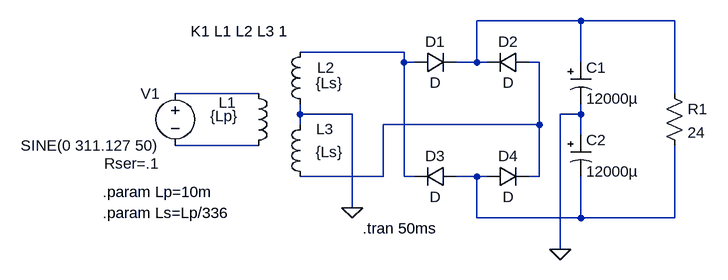
[diagram p0: schematic Rect and Filter - only.asc]
Rect and Filter - only.asc, the LTspice schematic file:
Version 4.1
SHEET 1 1676 728
WIRE 496 0 336 0
WIRE 640 0 496 0
WIRE 224 48 64 48
WIRE 224 64 224 48
WIRE 240 64 224 64
WIRE 336 64 336 0
WIRE 336 64 304 64
WIRE 352 64 336 64
WIRE 432 64 416 64
WIRE 496 64 496 0
WIRE 0 112 -128 112
WIRE 640 112 640 0
WIRE 64 144 64 128
WIRE 144 144 64 144
WIRE 496 144 496 128
WIRE 496 144 464 144
WIRE 64 160 64 144
WIRE 432 160 432 64
WIRE 432 160 192 160
WIRE 496 176 496 144
WIRE 0 192 -128 192
WIRE 192 240 192 160
WIRE 192 240 64 240
WIRE 224 240 224 64
WIRE 240 240 224 240
WIRE 336 240 304 240
WIRE 352 240 336 240
WIRE 432 240 432 160
WIRE 432 240 416 240
WIRE 144 288 144 144
WIRE 336 304 336 240
WIRE 496 304 496 240
WIRE 496 304 336 304
WIRE 640 304 640 192
WIRE 640 304 496 304
WIRE 464 352 464 144
FLAG 464 352 0
FLAG 144 288 0
SYMBOL diode 240 80 R270
WINDOW 0 32 32 VTop 2
WINDOW 3 0 32 VBottom 2
SYMATTR InstName D1
SYMBOL diode 416 80 M270
WINDOW 0 32 32 VTop 2
WINDOW 3 0 32 VBottom 2
SYMATTR InstName D2
SYMBOL diode 304 256 M270
WINDOW 0 32 32 VTop 2
WINDOW 3 0 32 VBottom 2
SYMATTR InstName D3
SYMBOL diode 352 256 R270
WINDOW 0 32 32 VTop 2
WINDOW 3 0 32 VBottom 2
SYMATTR InstName D4
SYMBOL polcap 480 64 R0
SYMATTR InstName C1
SYMATTR Value 12000µ
SYMBOL polcap 480 176 R0
SYMATTR InstName C2
SYMATTR Value 12000µ
SYMBOL voltage -128 96 M0
WINDOW 123 0 0 Left 0
WINDOW 39 24 124 Left 2
SYMATTR SpiceLine Rser=.1
SYMATTR InstName V1
SYMATTR Value SINE(0 311.127 50)
SYMBOL ind -16 208 M180
WINDOW 0 -45 82 Left 2
WINDOW 3 -58 61 Left 2
SYMATTR InstName L1
SYMATTR Value {Lp}
SYMATTR SpiceLine Rser=1m
SYMBOL ind 80 144 R180
WINDOW 0 -37 72 Left 2
WINDOW 3 -50 48 Left 2
SYMATTR InstName L2
SYMATTR Value {Ls}
SYMATTR SpiceLine Rser=1m
SYMBOL ind 80 256 R180
WINDOW 0 -36 89 Left 2
WINDOW 3 -50 54 Left 2
SYMATTR InstName L3
SYMATTR Value {Ls}
SYMATTR SpiceLine Rser=1m
SYMBOL res 624 96 R0
SYMATTR InstName R1
SYMATTR Value 24
TEXT 160 320 Left 2 !.tran 50ms
TEXT -104 16 Left 2 !K1 L1 L2 L3 1
TEXT -240 264 Left 2 !.param Lp=10m
TEXT -240 296 Left 2 !.param Ls=Lp/336

The netlist it stands for:
* Rect and Filter - only.asc
D1 N002 N001 D
D2 N003 N001 D
D3 N006 N002 D
D4 N006 N003 D
C1 N001 0 12000µ
C2 0 N006 12000µ
V1 N004 N005 SINE(0 311.127 50) Rser=.1
L1 N005 N004 {Lp} Rser=1m
L2 0 N002 {Ls} Rser=1m
L3 N003 0 {Ls} Rser=1m
R1 N001 N006 24
.model D D
.lib standard.dio
.tran 50ms
K1 L1 L2 L3 1
.param Lp=10m
.param Ls=Lp/336
.backanno
.end